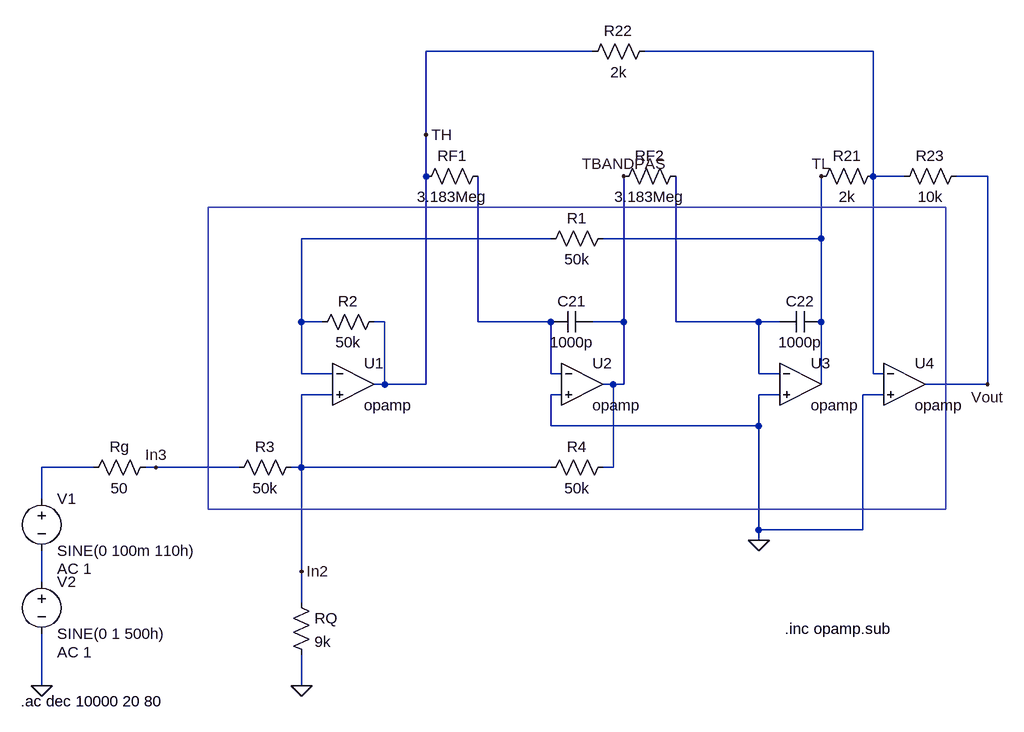
[diagram p0: schematic Filtro_Notch.asc]
Filtro_Notch.asc, the LTspice schematic file:
Version 4
SHEET 1 1036 680
WIRE 384 -368 128 -368
WIRE 816 -368 464 -368
WIRE 128 -240 128 -368
WIRE 128 -176 128 -240
WIRE 816 -176 816 -368
WIRE 864 -176 816 -176
WIRE 992 -176 944 -176
WIRE 320 -80 -64 -80
WIRE 736 -80 736 -176
WIRE 736 -80 400 -80
WIRE -64 48 -64 -80
WIRE -32 48 -64 48
WIRE 64 48 48 48
WIRE 208 48 208 -176
WIRE 320 48 208 48
WIRE 432 48 432 -176
WIRE 432 48 384 48
WIRE 512 48 512 -176
WIRE 640 48 512 48
WIRE 672 48 640 48
WIRE 736 48 736 -80
WIRE -64 128 -64 48
WIRE -16 128 -64 128
WIRE 320 128 320 48
WIRE 336 128 320 128
WIRE 640 128 640 48
WIRE 672 128 640 128
WIRE 816 128 816 -176
WIRE 832 128 816 128
WIRE 64 144 64 48
WIRE 64 144 48 144
WIRE 128 144 128 -176
WIRE 128 144 64 144
WIRE 416 144 400 144
WIRE 432 144 432 48
WIRE 432 144 416 144
WIRE 736 144 736 48
WIRE 992 144 992 -176
WIRE 992 144 896 144
WIRE -16 160 -64 160
WIRE 336 160 320 160
WIRE 672 160 640 160
WIRE 832 160 800 160
WIRE 320 208 320 160
WIRE 640 208 640 160
WIRE 640 208 320 208
WIRE -384 272 -464 272
WIRE -288 272 -304 272
WIRE -160 272 -288 272
WIRE -64 272 -64 160
WIRE -64 272 -80 272
WIRE 320 272 -64 272
WIRE 416 272 416 144
WIRE 416 272 400 272
WIRE -464 320 -464 272
WIRE 640 368 640 208
WIRE 800 368 800 160
WIRE 800 368 640 368
WIRE 640 384 640 368
WIRE -64 432 -64 272
WIRE -464 448 -464 400
WIRE -64 480 -64 432
WIRE -464 608 -464 528
WIRE -64 608 -64 560
FLAG 128 -240 TH
FLAG 432 -176 TBANDPAS
FLAG 736 -176 TL
FLAG -64 432 In2
FLAG -288 272 In3
FLAG 640 384 0
FLAG 992 144 Vout
FLAG -64 608 0
FLAG -464 608 0
SYMBOL OpAmps\\opamp 16 80 R0
SYMATTR InstName U1
SYMBOL OpAmps\\opamp 368 80 R0
SYMATTR InstName U2
SYMBOL OpAmps\\opamp 704 80 R0
SYMATTR InstName U3
SYMBOL OpAmps\\opamp 864 80 R0
SYMATTR InstName U4
SYMBOL res -64 256 R90
WINDOW 0 0 56 VBottom 2
WINDOW 3 32 56 VTop 2
SYMATTR InstName R3
SYMATTR Value 50k
SYMBOL res 64 32 R90
WINDOW 0 0 56 VBottom 2
WINDOW 3 32 56 VTop 2
SYMATTR InstName R2
SYMATTR Value 50k
SYMBOL cap 384 32 R90
WINDOW 0 0 32 VBottom 2
WINDOW 3 32 32 VTop 2
SYMATTR InstName C21
SYMATTR Value 1000p
SYMBOL res 416 -96 R90
WINDOW 0 0 56 VBottom 2
WINDOW 3 32 56 VTop 2
SYMATTR InstName R1
SYMATTR Value 50k
SYMBOL cap 736 32 R90
WINDOW 0 0 32 VBottom 2
WINDOW 3 32 32 VTop 2
SYMATTR InstName C22
SYMATTR Value 1000p
SYMBOL res 416 256 R90
WINDOW 0 0 56 VBottom 2
WINDOW 3 32 56 VTop 2
SYMATTR InstName R4
SYMATTR Value 50k
SYMBOL res 416 -160 R270
WINDOW 0 32 56 VTop 2
WINDOW 3 0 56 VBottom 2
SYMATTR InstName RF2
SYMATTR Value 3.183Meg
SYMBOL res 224 -192 R90
WINDOW 0 0 56 VBottom 2
WINDOW 3 32 56 VTop 2
SYMATTR InstName RF1
SYMATTR Value 3.183Meg
SYMBOL res 480 -384 R90
WINDOW 0 0 56 VBottom 2
WINDOW 3 32 56 VTop 2
SYMATTR InstName R22
SYMATTR Value 2k
SYMBOL res 832 -192 R90
WINDOW 0 0 56 VBottom 2
WINDOW 3 32 56 VTop 2
SYMATTR InstName R21
SYMATTR Value 2k
SYMBOL res 960 -192 R90
WINDOW 0 0 56 VBottom 2
WINDOW 3 32 56 VTop 2
SYMATTR InstName R23
SYMATTR Value 10k
SYMBOL res -80 464 R0
SYMATTR InstName RQ
SYMATTR Value 9k
SYMBOL voltage -464 304 R0
WINDOW 123 24 124 Left 2
WINDOW 39 0 0 Left 0
SYMATTR Value2 AC 1
SYMATTR InstName V1
SYMATTR Value SINE(0 100m 110h)
SYMBOL voltage -464 432 R0
WINDOW 123 24 124 Left 2
WINDOW 39 0 0 Left 0
SYMATTR Value2 AC 1
SYMATTR InstName V2
SYMATTR Value SINE(0 1 500h)
SYMBOL res -288 256 R90
WINDOW 0 0 56 VBottom 2
WINDOW 3 32 56 VTop 2
SYMATTR InstName Rg
SYMATTR Value 50
TEXT 680 520 Left 2 !.inc opamp.sub
TEXT -496 632 Left 2 !.ac dec 10000 20 80
RECTANGLE Normal 928 336 -208 -128

The netlist it stands for:
* Filtro_Notch.asc
XU1 N002 In2 TH opamp Aol=100K GBW=10Meg  ; pins invin noninvin out
XU2 N003 0 TBANDPAS opamp Aol=100K GBW=10Meg  ; pins invin noninvin out
XU3 N004 0 TL opamp Aol=100K GBW=10Meg  ; pins invin noninvin out
XU4 N001 0 Vout opamp Aol=100K GBW=10Meg  ; pins invin noninvin out
R3 In2 In3 50k
R2 TH N002 50k
C21 TBANDPAS N003 1000p
R1 TL N002 50k
C22 TL N004 1000p
R4 TBANDPAS In2 50k
RF2 TBANDPAS N004 3.183Meg
RF1 N003 TH 3.183Meg
R22 N001 TH 2k
R21 N001 TL 2k
R23 Vout N001 10k
RQ In2 0 9k
V1 N005 N006 SINE(0 100m 110h) AC 1
V2 N006 0 SINE(0 1 500h) AC 1
Rg In3 N005 50
.inc opamp.sub
.ac dec 10000 20 80
.backanno
.end